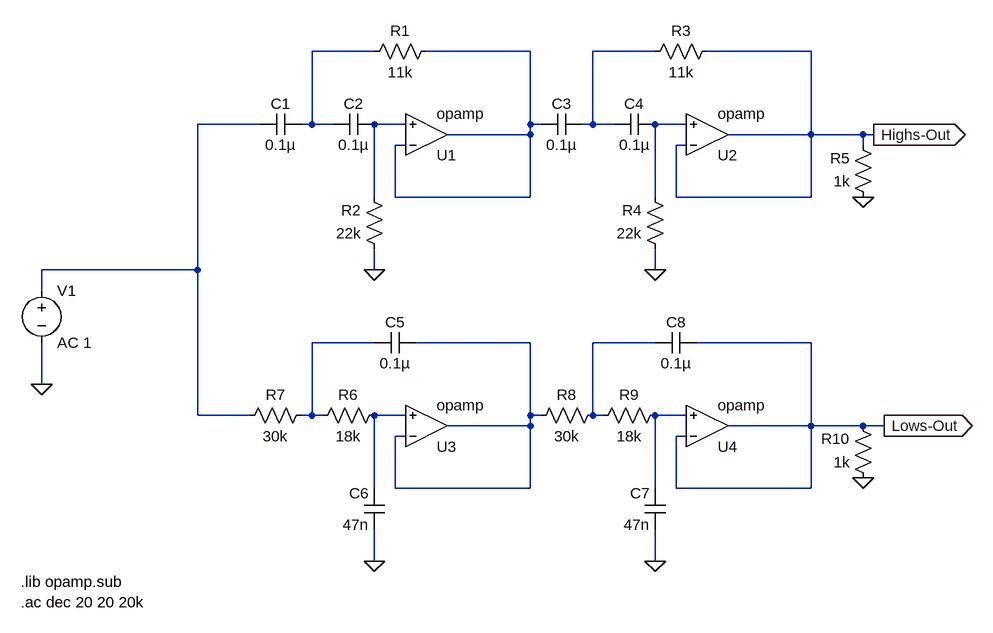
[diagram p0: schematic CrossoverFilterAnalysis.asc]
CrossoverFilterAnalysis.asc, the LTspice schematic file:
Version 4.1
SHEET 1 2132 1684
WIRE -2000 -1056 -2096 -1056
WIRE -1760 -1056 -1920 -1056
WIRE -1568 -1056 -1664 -1056
WIRE -1328 -1056 -1488 -1056
WIRE -2176 -944 -2272 -944
WIRE -2096 -944 -2096 -1056
WIRE -2096 -944 -2112 -944
WIRE -2064 -944 -2096 -944
WIRE -1952 -944 -2000 -944
WIRE -1760 -944 -1760 -1056
WIRE -1744 -944 -1760 -944
WIRE -1664 -944 -1664 -1056
WIRE -1664 -944 -1680 -944
WIRE -1632 -944 -1664 -944
WIRE -1520 -944 -1568 -944
WIRE -1760 -928 -1760 -944
WIRE -1760 -928 -1888 -928
WIRE -1328 -928 -1328 -1056
WIRE -1328 -928 -1456 -928
WIRE -1248 -928 -1328 -928
WIRE -1232 -928 -1248 -928
WIRE -1952 -912 -1968 -912
WIRE -1520 -912 -1536 -912
WIRE -1248 -912 -1248 -928
WIRE -2000 -832 -2000 -944
WIRE -1968 -832 -1968 -912
WIRE -1760 -832 -1760 -928
WIRE -1760 -832 -1968 -832
WIRE -1568 -832 -1568 -944
WIRE -1536 -832 -1536 -912
WIRE -1328 -832 -1328 -928
WIRE -1328 -832 -1536 -832
WIRE -2272 -720 -2272 -944
WIRE -2272 -720 -2512 -720
WIRE -2000 -720 -2000 -752
WIRE -1568 -720 -1568 -752
WIRE -2512 -688 -2512 -720
WIRE -2000 -608 -2096 -608
WIRE -1760 -608 -1936 -608
WIRE -1568 -608 -1664 -608
WIRE -1328 -608 -1504 -608
WIRE -2512 -544 -2512 -608
WIRE -2272 -496 -2272 -720
WIRE -2192 -496 -2272 -496
WIRE -2096 -496 -2096 -608
WIRE -2096 -496 -2112 -496
WIRE -2080 -496 -2096 -496
WIRE -1952 -496 -2000 -496
WIRE -1760 -496 -1760 -608
WIRE -1744 -496 -1760 -496
WIRE -1664 -496 -1664 -608
WIRE -1648 -496 -1664 -496
WIRE -1520 -496 -1568 -496
WIRE -1760 -480 -1760 -496
WIRE -1760 -480 -1888 -480
WIRE -1328 -480 -1328 -608
WIRE -1328 -480 -1456 -480
WIRE -1248 -480 -1328 -480
WIRE -1216 -480 -1248 -480
WIRE -1952 -464 -1968 -464
WIRE -1520 -464 -1536 -464
WIRE -2000 -384 -2000 -496
WIRE -1968 -384 -1968 -464
WIRE -1760 -384 -1760 -480
WIRE -1760 -384 -1968 -384
WIRE -1568 -384 -1568 -496
WIRE -1536 -384 -1536 -464
WIRE -1328 -384 -1328 -480
WIRE -1328 -384 -1536 -384
WIRE -2000 -272 -2000 -320
WIRE -1568 -272 -1568 -320
FLAG -2000 -720 0
FLAG -1568 -720 0
FLAG -2000 -272 0
FLAG -1568 -272 0
FLAG -1248 -832 0
FLAG -1232 -928 Highs-Out
IOPIN -1232 -928 Out
FLAG -1216 -480 Lows-Out
IOPIN -1216 -480 Out
FLAG -1248 -400 0
FLAG -2512 -544 0
SYMBOL cap -2112 -960 R90
WINDOW 0 0 32 VBottom 2
WINDOW 3 32 32 VTop 2
SYMATTR InstName C1
SYMATTR Value 0.1µ
SYMBOL cap -2000 -960 R90
WINDOW 0 0 32 VBottom 2
WINDOW 3 32 32 VTop 2
SYMATTR InstName C2
SYMATTR Value 0.1µ
SYMBOL res -1904 -1072 R90
WINDOW 0 0 56 VBottom 2
WINDOW 3 32 56 VTop 2
SYMATTR InstName R1
SYMATTR Value 11k
SYMBOL res -1984 -736 R180
WINDOW 0 36 76 Left 2
WINDOW 3 36 40 Left 2
SYMATTR InstName R2
SYMATTR Value 22k
SYMBOL res -1232 -816 R180
WINDOW 0 36 76 Left 2
WINDOW 3 36 40 Left 2
SYMATTR InstName R5
SYMATTR Value 1k
SYMBOL res -1232 -384 R180
WINDOW 0 36 76 Left 2
WINDOW 3 36 40 Left 2
SYMATTR InstName R10
SYMATTR Value 1k
SYMBOL cap -1936 -624 R90
WINDOW 0 0 32 VBottom 2
WINDOW 3 32 32 VTop 2
SYMATTR InstName C5
SYMATTR Value 0.1µ
SYMBOL cap -1984 -320 R180
WINDOW 0 24 56 Left 2
WINDOW 3 24 8 Left 2
SYMATTR InstName C6
SYMATTR Value 47n
SYMBOL cap -1552 -320 R180
WINDOW 0 24 56 Left 2
WINDOW 3 24 8 Left 2
SYMATTR InstName C7
SYMATTR Value 47n
SYMBOL res -1984 -512 R90
WINDOW 0 0 56 VBottom 2
WINDOW 3 32 56 VTop 2
SYMATTR InstName R6
SYMATTR Value 18k
SYMBOL res -2096 -512 R90
WINDOW 0 0 56 VBottom 2
WINDOW 3 32 56 VTop 2
SYMATTR InstName R7
SYMATTR Value 30k
SYMBOL OpAmps\\opamp -1920 -864 M180
SYMATTR InstName U1
SYMBOL OpAmps\\opamp -1488 -864 M180
SYMATTR InstName U2
SYMBOL OpAmps\\opamp -1920 -416 M180
SYMATTR InstName U3
SYMBOL OpAmps\\opamp -1488 -416 M180
SYMATTR InstName U4
SYMBOL voltage -2512 -704 R0
SYMATTR InstName V1
SYMATTR Value AC 1
SYMBOL res -1648 -512 R90
WINDOW 0 0 56 VBottom 2
WINDOW 3 32 56 VTop 2
SYMATTR InstName R8
SYMATTR Value 30k
SYMBOL res -1552 -512 R90
WINDOW 0 0 56 VBottom 2
WINDOW 3 32 56 VTop 2
SYMATTR InstName R9
SYMATTR Value 18k
SYMBOL cap -1504 -624 R90
WINDOW 0 0 32 VBottom 2
WINDOW 3 32 32 VTop 2
SYMATTR InstName C8
SYMATTR Value 0.1µ
SYMBOL cap -1680 -960 R90
WINDOW 0 0 32 VBottom 2
WINDOW 3 32 32 VTop 2
SYMATTR InstName C3
SYMATTR Value 0.1µ
SYMBOL cap -1568 -960 R90
WINDOW 0 0 32 VBottom 2
WINDOW 3 32 32 VTop 2
SYMATTR InstName C4
SYMATTR Value 0.1µ
SYMBOL res -1472 -1072 R90
WINDOW 0 0 56 VBottom 2
WINDOW 3 32 56 VTop 2
SYMATTR InstName R3
SYMATTR Value 11k
SYMBOL res -1552 -736 R180
WINDOW 0 36 76 Left 2
WINDOW 3 36 40 Left 2
SYMATTR InstName R4
SYMATTR Value 22k
TEXT -2544 -240 Left 2 !.lib opamp.sub\n.ac dec 20 20 20k

The netlist it stands for:
* CrossoverFilterAnalysis.asc
C1 N001 N004 0.1µ
C2 N005 N001 0.1µ
R1 N002 N001 11k
R2 0 N005 22k
R5 0 Highs-Out 1k
R10 0 Lows-Out 1k
C5 N008 N007 0.1µ
C6 0 N010 47n
C7 0 N011 47n
R6 N010 N007 18k
R7 N007 N004 30k
X§U1 N002 N005 N002 opamp Aol=100K GBW=10Meg  ; pins invin noninvin out
X§U2 Highs-Out N006 Highs-Out opamp Aol=100K GBW=10Meg  ; pins invin noninvin out
X§U3 N008 N010 N008 opamp Aol=100K GBW=10Meg  ; pins invin noninvin out
X§U4 Lows-Out N011 Lows-Out opamp Aol=100K GBW=10Meg  ; pins invin noninvin out
V1 N004 0 AC 1
R8 N009 N008 30k
R9 N011 N009 18k
C8 Lows-Out N009 0.1µ
C3 N003 N002 0.1µ
C4 N006 N003 0.1µ
R3 Highs-Out N003 11k
R4 0 N006 22k
.lib opamp.sub
.ac dec 20 20 20k
.backanno
.end